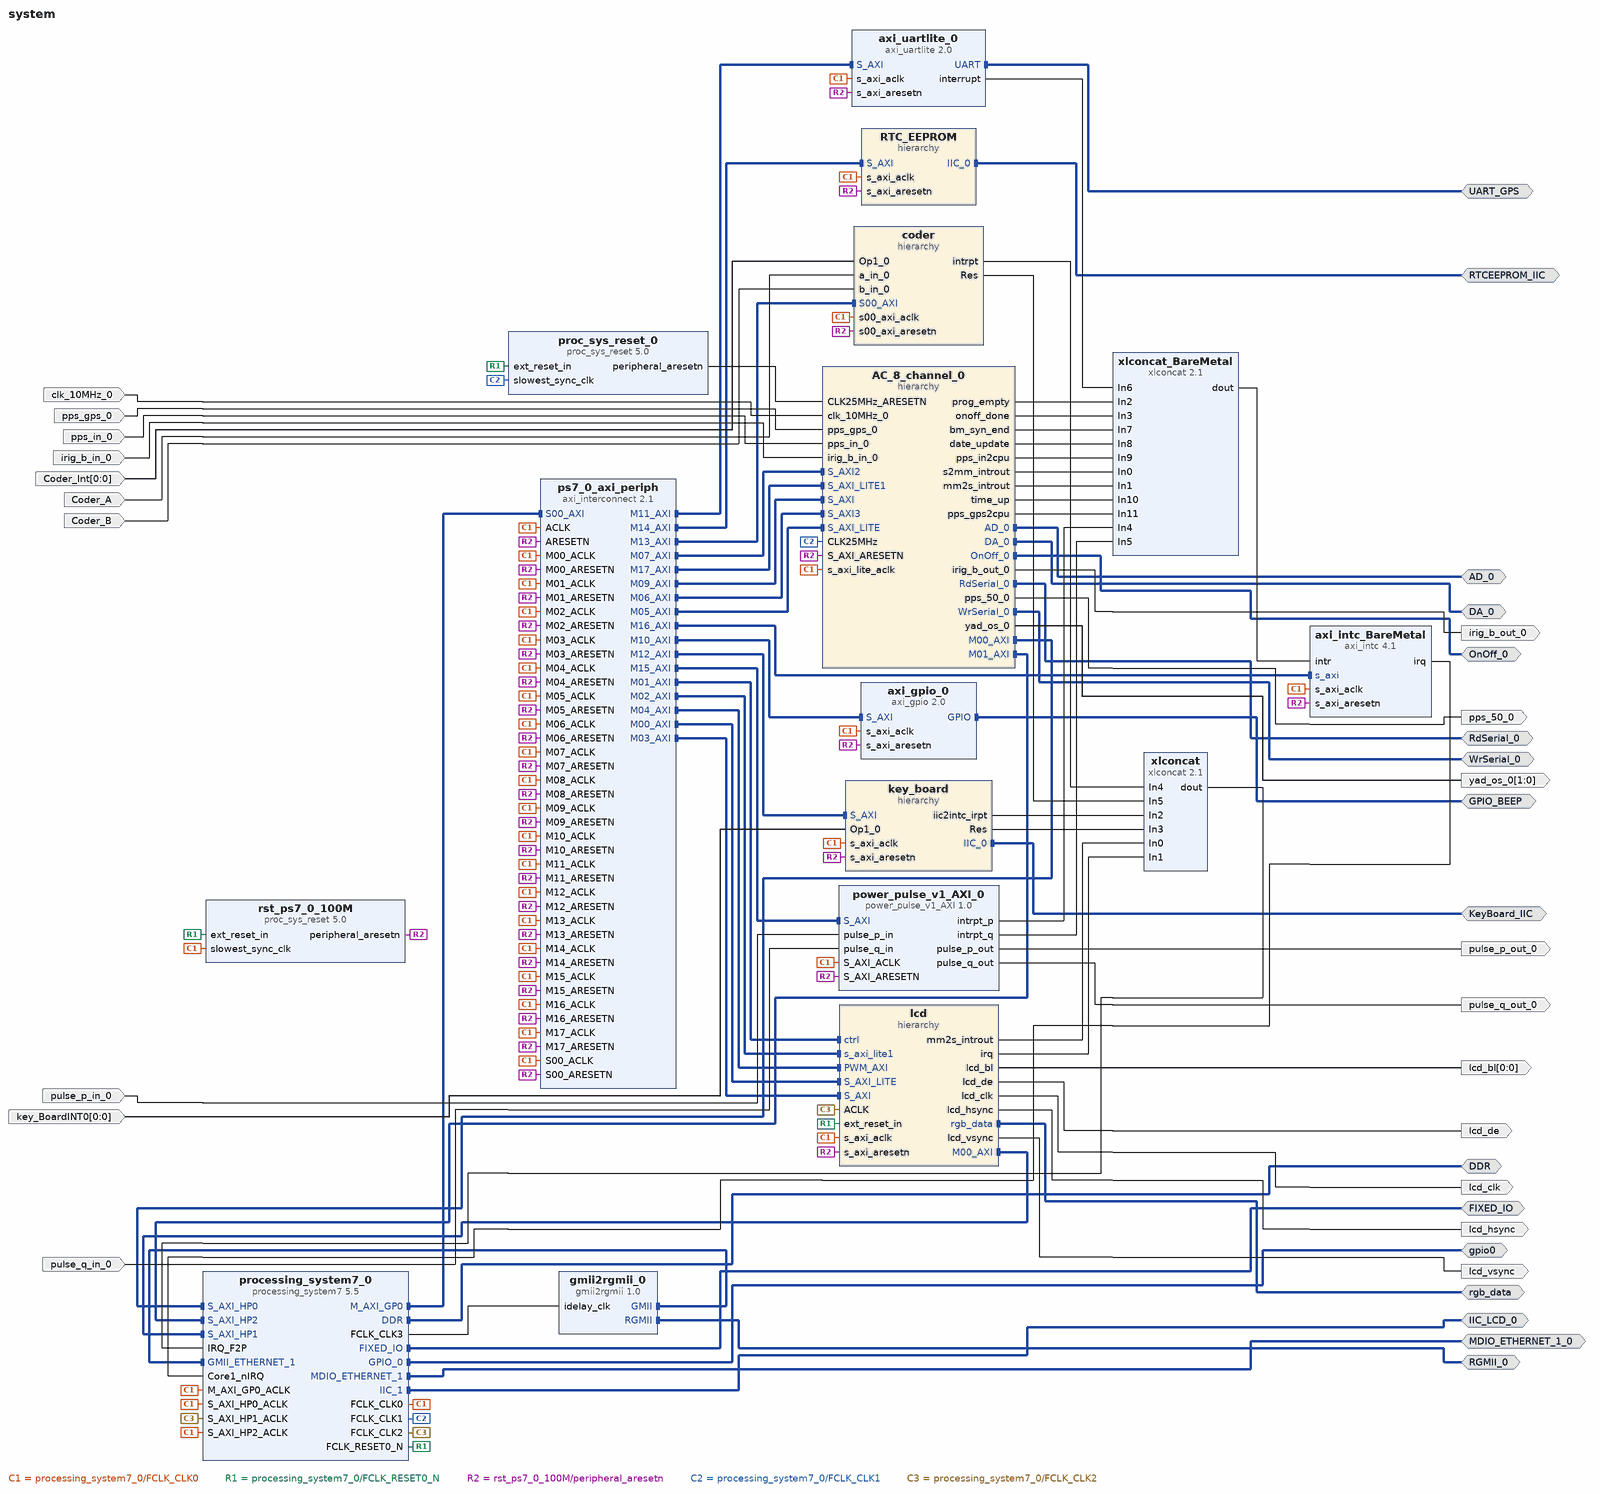
[diagram p0: block diagram of the top level]
# Vivado block design system, xc7z020clg400-2, Vivado 2020.2
create_bd_design system

create_bd_intf_port -mode Master -vlnv xilinx.com:interface:ddrx_rtl:1.0 DDR
create_bd_intf_port -mode Master -vlnv xilinx.com:display_processing_system7:fixedio_rtl:1.0 FIXED_IO
create_bd_intf_port -mode Master -vlnv xilinx.com:interface:gpio_rtl:1.0 rgb_data
create_bd_intf_port -mode Master -vlnv xilinx.com:user:AD_rtl:1.0 AD_0
create_bd_intf_port -mode Master -vlnv xilinx.com:user:DA_rtl:1.0 DA_0
create_bd_intf_port -mode Master -vlnv xilinx.com:user:WrSerial_rtl:1.0 WrSerial_0
create_bd_intf_port -mode Master -vlnv xilinx.com:user:OnOff_rtl:1.0 OnOff_0
create_bd_intf_port -mode Master -vlnv xilinx.com:user:RdSerial_rtl:1.0 RdSerial_0
create_bd_intf_port -mode Master -vlnv xilinx.com:interface:gpio_rtl:1.0 GPIO_BEEP
create_bd_intf_port -mode Master -vlnv xilinx.com:interface:uart_rtl:1.0 UART_GPS
create_bd_intf_port -mode Master -vlnv xilinx.com:interface:iic_rtl:1.0 KeyBoard_IIC
create_bd_intf_port -mode Master -vlnv xilinx.com:interface:rgmii_rtl:1.0 RGMII_0
create_bd_intf_port -mode Master -vlnv xilinx.com:interface:mdio_rtl:1.0 MDIO_ETHERNET_1_0
create_bd_intf_port -mode Master -vlnv xilinx.com:interface:gpio_rtl:1.0 gpio0
create_bd_intf_port -mode Master -vlnv xilinx.com:interface:iic_rtl:1.0 IIC_LCD_0
create_bd_intf_port -mode Master -vlnv xilinx.com:interface:iic_rtl:1.0 RTCEEPROM_IIC
create_bd_port -dir O -from 0 -to 0 lcd_bl
create_bd_port -dir O lcd_de
create_bd_port -dir O lcd_hsync
create_bd_port -dir O lcd_vsync
create_bd_port -dir O -type clk lcd_clk
create_bd_port -dir I -from 0 -to 0 Coder_Int
create_bd_port -dir I Coder_A
create_bd_port -dir I Coder_B
create_bd_port -dir O pulse_p_out_0
create_bd_port -dir O pulse_q_out_0
create_bd_port -dir I pulse_p_in_0
create_bd_port -dir I pulse_q_in_0
create_bd_port -dir O -from 1 -to 0 yad_os_0
create_bd_port -dir I -from 0 -to 0 key_BoardINT0
create_bd_port -dir I clk_10MHz_0
create_bd_port -dir I pps_gps_0
create_bd_port -dir I pps_in_0
create_bd_port -dir I irig_b_in_0
create_bd_port -dir O pps_50_0
create_bd_port -dir O irig_b_out_0

create_bd_cell -type ip -vlnv xilinx.com:ip:processing_system7:5.5 processing_system7_0
set_property -dict [list \
  CONFIG.PCW_APU_PERIPHERAL_FREQMHZ 666.666666 \
  CONFIG.PCW_CORE1_IRQ_INTR 1 \
  CONFIG.PCW_CPU_CPU_6X4X_MAX_RANGE 767 \
  CONFIG.PCW_ENET0_ENET0_IO {MIO 16 .. 27} \
  CONFIG.PCW_ENET0_GRP_MDIO_ENABLE 1 \
  CONFIG.PCW_ENET0_GRP_MDIO_IO {MIO 52 .. 53} \
  CONFIG.PCW_ENET0_PERIPHERAL_ENABLE 1 \
  CONFIG.PCW_ENET0_RESET_ENABLE 0 \
  CONFIG.PCW_ENET1_ENET1_IO EMIO \
  CONFIG.PCW_ENET1_GRP_MDIO_ENABLE 1 \
  CONFIG.PCW_ENET1_GRP_MDIO_IO EMIO \
  CONFIG.PCW_ENET1_PERIPHERAL_ENABLE 1 \
  CONFIG.PCW_ENET_RESET_ENABLE 1 \
  CONFIG.PCW_ENET_RESET_SELECT {Share reset pin} \
  CONFIG.PCW_EN_CLK1_PORT 1 \
  CONFIG.PCW_EN_CLK2_PORT 1 \
  CONFIG.PCW_EN_CLK3_PORT 1 \
  CONFIG.PCW_FCLK_CLK1_BUF TRUE \
  CONFIG.PCW_FCLK_CLK2_BUF TRUE \
  CONFIG.PCW_FCLK_CLK3_BUF TRUE \
  CONFIG.PCW_FPGA0_PERIPHERAL_FREQMHZ 100 \
  CONFIG.PCW_FPGA1_PERIPHERAL_FREQMHZ 25 \
  CONFIG.PCW_FPGA2_PERIPHERAL_FREQMHZ 150 \
  CONFIG.PCW_FPGA3_PERIPHERAL_FREQMHZ 200 \
  CONFIG.PCW_FPGA_FCLK1_ENABLE 1 \
  CONFIG.PCW_FPGA_FCLK2_ENABLE 1 \
  CONFIG.PCW_FPGA_FCLK3_ENABLE 1 \
  CONFIG.PCW_GPIO_EMIO_GPIO_ENABLE 1 \
  CONFIG.PCW_GPIO_EMIO_GPIO_IO 3 \
  CONFIG.PCW_GPIO_EMIO_GPIO_WIDTH 3 \
  CONFIG.PCW_GPIO_MIO_GPIO_ENABLE 1 \
  CONFIG.PCW_GPIO_MIO_GPIO_IO MIO \
  CONFIG.PCW_I2C1_I2C1_IO EMIO \
  CONFIG.PCW_I2C1_PERIPHERAL_ENABLE 1 \
  CONFIG.PCW_I2C_PERIPHERAL_FREQMHZ 111.111115 \
  CONFIG.PCW_I2C_RESET_ENABLE 1 \
  CONFIG.PCW_I2C_RESET_SELECT {Share reset pin} \
  CONFIG.PCW_IRQ_F2P_INTR 1 \
  CONFIG.PCW_PERIPHERAL_BOARD_PRESET None \
  CONFIG.PCW_PRESET_BANK1_VOLTAGE {LVCMOS 1.8V} \
  CONFIG.PCW_QSPI_GRP_SINGLE_SS_ENABLE 1 \
  CONFIG.PCW_QSPI_GRP_SINGLE_SS_IO {MIO 1 .. 6} \
  CONFIG.PCW_QSPI_PERIPHERAL_ENABLE 1 \
  CONFIG.PCW_QSPI_QSPI_IO {MIO 1 .. 6} \
  CONFIG.PCW_SD0_GRP_CD_ENABLE 1 \
  CONFIG.PCW_SD0_GRP_CD_IO {MIO 9} \
  CONFIG.PCW_SD0_GRP_WP_ENABLE 0 \
  CONFIG.PCW_SD0_PERIPHERAL_ENABLE 1 \
  CONFIG.PCW_SD0_SD0_IO {MIO 40 .. 45} \
  CONFIG.PCW_SD1_PERIPHERAL_ENABLE 1 \
  CONFIG.PCW_SD1_SD1_IO {MIO 46 .. 51} \
  CONFIG.PCW_SDIO_PERIPHERAL_FREQMHZ 100 \
  CONFIG.PCW_SINGLE_QSPI_DATA_MODE x4 \
  CONFIG.PCW_TTC0_PERIPHERAL_ENABLE 1 \
  CONFIG.PCW_TTC0_TTC0_IO EMIO \
  CONFIG.PCW_UART0_PERIPHERAL_ENABLE 1 \
  CONFIG.PCW_UART0_UART0_IO {MIO 14 .. 15} \
  CONFIG.PCW_UART1_PERIPHERAL_ENABLE 1 \
  CONFIG.PCW_UART1_UART1_IO {MIO 12 .. 13} \
  CONFIG.PCW_UART_PERIPHERAL_FREQMHZ 100 \
  CONFIG.PCW_UIPARAM_DDR_FREQ_MHZ 533.333333 \
  CONFIG.PCW_UIPARAM_DDR_PARTNO {MT41J256M16 RE-125} \
  CONFIG.PCW_USB0_PERIPHERAL_ENABLE 1 \
  CONFIG.PCW_USB0_RESET_ENABLE 1 \
  CONFIG.PCW_USB0_RESET_IO {MIO 8} \
  CONFIG.PCW_USB0_USB0_IO {MIO 28 .. 39} \
  CONFIG.PCW_USB_RESET_ENABLE 1 \
  CONFIG.PCW_USB_RESET_SELECT {Share reset pin} \
  CONFIG.PCW_USE_FABRIC_INTERRUPT 1 \
  CONFIG.PCW_USE_S_AXI_HP0 1 \
  CONFIG.PCW_USE_S_AXI_HP1 1 \
  CONFIG.PCW_USE_S_AXI_HP2 1 \
] [get_bd_cells processing_system7_0]
# 518 more settings of processing_system7_0 are not shown: defaults, MIO pin electricals, DDR timing, and values the tool derives
create_bd_cell -type ip -vlnv xilinx.com:ip:proc_sys_reset:5.0 rst_ps7_0_100M
create_bd_cell -type ip -vlnv xilinx.com:ip:axi_interconnect:2.1 ps7_0_axi_periph
set_property -dict {CONFIG.NUM_MI 18} [get_bd_cells ps7_0_axi_periph]
create_bd_cell -type ip -vlnv xilinx.com:ip:proc_sys_reset:5.0 proc_sys_reset_0
create_bd_cell -type ip -vlnv xilinx.com:ip:xlconcat:2.1 xlconcat
set_property -dict {CONFIG.NUM_PORTS 6} [get_bd_cells xlconcat]
create_bd_cell -type hier lcd
create_bd_cell -type ip -vlnv xilinx.com:ip:axi_gpio:2.0 axi_gpio_0
set_property -dict {CONFIG.C_ALL_INPUTS 0 CONFIG.C_ALL_OUTPUTS 1 CONFIG.C_GPIO_WIDTH 1} [get_bd_cells axi_gpio_0]
create_bd_cell -type ip -vlnv xilinx.com:ip:axi_uartlite:2.0 axi_uartlite_0
set_property -dict {CONFIG.C_BAUDRATE 9600} [get_bd_cells axi_uartlite_0]
create_bd_cell -type hier key_board
create_bd_cell -type hier coder
create_bd_cell -type ip -vlnv xilinx.com:user:gmii2rgmii:1.0 gmii2rgmii_0
create_bd_cell -type hier AC_8_channel_0
create_bd_cell -type hier RTC_EEPROM
create_bd_cell -type ip -vlnv xilinx.com:user:power_pulse_v1_AXI:1.0 power_pulse_v1_AXI_0
create_bd_cell -type ip -vlnv xilinx.com:ip:axi_intc:4.1 axi_intc_BareMetal
set_property -dict [list \
  CONFIG.C_IRQ_CONNECTION 1 \
  CONFIG.C_IRQ_IS_LEVEL 1 \
  CONFIG.C_KIND_OF_INTR 0xFFFFFFFF \
  CONFIG.C_NUM_SW_INTR 0 \
] [get_bd_cells axi_intc_BareMetal]
create_bd_cell -type ip -vlnv xilinx.com:ip:xlconcat:2.1 xlconcat_BareMetal
set_property -dict {CONFIG.NUM_PORTS 12} [get_bd_cells xlconcat_BareMetal]

# ---- hierarchy /lcd ----
current_bd_instance /lcd
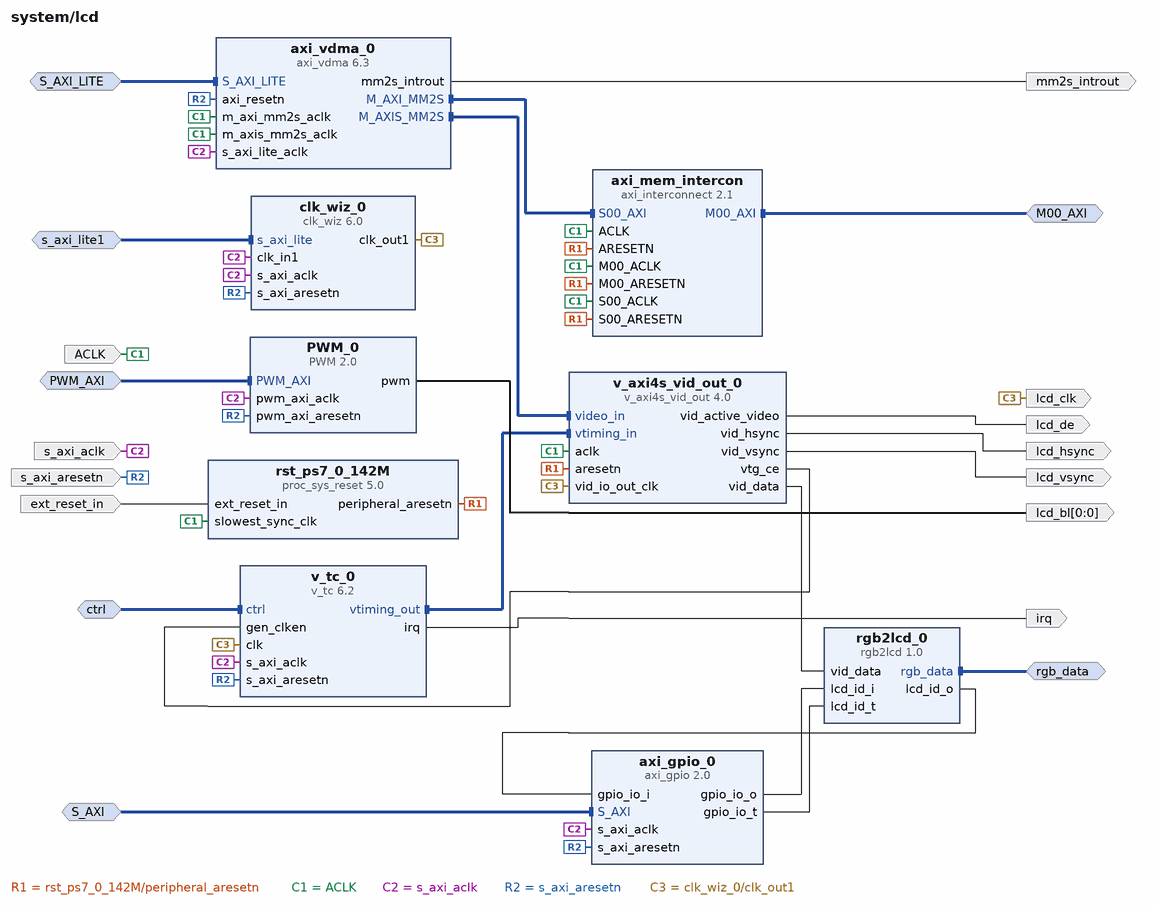
[diagram p1: block diagram inside /lcd]
create_bd_intf_pin -mode Slave -vlnv xilinx.com:interface:aximm_rtl:1.0 S_AXI_LITE
create_bd_intf_pin -mode Slave -vlnv xilinx.com:interface:aximm_rtl:1.0 S_AXI
create_bd_intf_pin -mode Master -vlnv xilinx.com:interface:gpio_rtl:1.0 rgb_data
create_bd_intf_pin -mode Slave -vlnv xilinx.com:interface:aximm_rtl:1.0 ctrl
create_bd_intf_pin -mode Slave -vlnv xilinx.com:interface:aximm_rtl:1.0 s_axi_lite1
create_bd_intf_pin -mode Slave -vlnv xilinx.com:interface:aximm_rtl:1.0 PWM_AXI
create_bd_intf_pin -mode Master -vlnv xilinx.com:interface:aximm_rtl:1.0 M00_AXI
create_bd_pin -dir I -type clk ACLK
create_bd_pin -dir I -type rst ext_reset_in
create_bd_pin -dir I -type clk s_axi_aclk
create_bd_pin -dir I -type rst s_axi_aresetn
create_bd_pin -dir O -type intr mm2s_introut
create_bd_pin -dir O -type clk lcd_clk
create_bd_pin -dir O lcd_de
create_bd_pin -dir O lcd_vsync
create_bd_pin -dir O lcd_hsync
create_bd_pin -dir O -type intr irq
create_bd_pin -dir O -from 0 -to 0 lcd_bl

create_bd_cell -type ip -vlnv xilinx.com:ip:proc_sys_reset:5.0 rst_ps7_0_142M
create_bd_cell -type ip -vlnv xilinx.com:ip:axi_vdma:6.3 axi_vdma_0
set_property -dict [list \
  CONFIG.c_include_s2mm 0 \
  CONFIG.c_m_axis_mm2s_tdata_width 24 \
  CONFIG.c_mm2s_linebuffer_depth 4096 \
  CONFIG.c_mm2s_max_burst_length 16 \
  CONFIG.c_num_fstores 1 \
] [get_bd_cells axi_vdma_0]
create_bd_cell -type ip -vlnv xilinx.com:ip:axi_gpio:2.0 axi_gpio_0
set_property -dict {CONFIG.C_GPIO_WIDTH 3} [get_bd_cells axi_gpio_0]
create_bd_cell -type ip -vlnv xilinx.com:ip:v_axi4s_vid_out:4.0 v_axi4s_vid_out_0
set_property -dict {CONFIG.C_HAS_ASYNC_CLK 1} [get_bd_cells v_axi4s_vid_out_0]
create_bd_cell -type ip -vlnv xilinx.com:ip:v_tc:6.2 v_tc_0
set_property -dict {CONFIG.enable_detection false} [get_bd_cells v_tc_0]
create_bd_cell -type ip -vlnv xilinx.com:ip:clk_wiz:6.0 clk_wiz_0
set_property -dict [list \
  CONFIG.CLKOUT2_REQUESTED_OUT_FREQ 100.000 \
  CONFIG.CLKOUT2_USED false \
  CONFIG.CLKOUT3_REQUESTED_OUT_FREQ 100.000 \
  CONFIG.CLKOUT3_USED false \
  CONFIG.MMCM_CLKOUT1_DIVIDE 1 \
  CONFIG.MMCM_CLKOUT2_DIVIDE 1 \
  CONFIG.NUM_OUT_CLKS 1 \
  CONFIG.USE_DYN_RECONFIG true \
  CONFIG.USE_RESET true \
] [get_bd_cells clk_wiz_0]
create_bd_cell -type ip -vlnv digilentinc.com:IP:PWM:2.0 PWM_0
create_bd_cell -type ip -vlnv xilinx.com:ip:axi_interconnect:2.1 axi_mem_intercon
set_property -dict {CONFIG.NUM_MI 1} [get_bd_cells axi_mem_intercon]
create_bd_cell -type ip -vlnv openedv.com:user:rgb2lcd:1.0 rgb2lcd_0

# ---- hierarchy /key_board ----
current_bd_instance /key_board
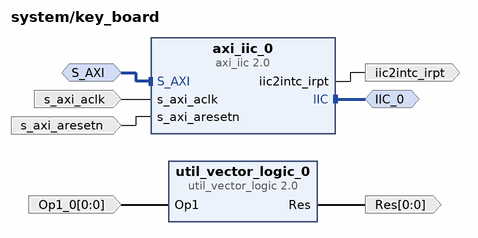
[diagram p2: block diagram inside /key_board]
create_bd_intf_pin -mode Master -vlnv xilinx.com:interface:iic_rtl:1.0 IIC_0
create_bd_intf_pin -mode Slave -vlnv xilinx.com:interface:aximm_rtl:1.0 S_AXI
create_bd_pin -dir I -from 0 -to 0 Op1_0
create_bd_pin -dir O -from 0 -to 0 Res
create_bd_pin -dir I -type clk s_axi_aclk
create_bd_pin -dir I -type rst s_axi_aresetn
create_bd_pin -dir O -type intr iic2intc_irpt

create_bd_cell -type ip -vlnv xilinx.com:ip:axi_iic:2.0 axi_iic_0
create_bd_cell -type ip -vlnv xilinx.com:ip:util_vector_logic:2.0 util_vector_logic_0
set_property -dict {CONFIG.C_OPERATION not CONFIG.C_SIZE 1} [get_bd_cells util_vector_logic_0]

# ---- hierarchy /coder ----
current_bd_instance /coder
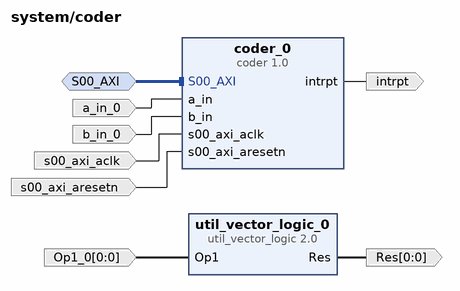
[diagram p3: block diagram inside /coder]
create_bd_intf_pin -mode Slave -vlnv xilinx.com:interface:aximm_rtl:1.0 S00_AXI
create_bd_pin -dir O intrpt
create_bd_pin -dir O -from 0 -to 0 Res
create_bd_pin -dir I -from 0 -to 0 Op1_0
create_bd_pin -dir I a_in_0
create_bd_pin -dir I b_in_0
create_bd_pin -dir I -type clk s00_axi_aclk
create_bd_pin -dir I -type rst s00_axi_aresetn

create_bd_cell -type ip -vlnv xilinx.com:user:coder:1.0 coder_0
create_bd_cell -type ip -vlnv xilinx.com:ip:util_vector_logic:2.0 util_vector_logic_0
set_property -dict {CONFIG.C_OPERATION not CONFIG.C_SIZE 1} [get_bd_cells util_vector_logic_0]

# ---- hierarchy /AC_8_channel_0 ----
current_bd_instance /AC_8_channel_0
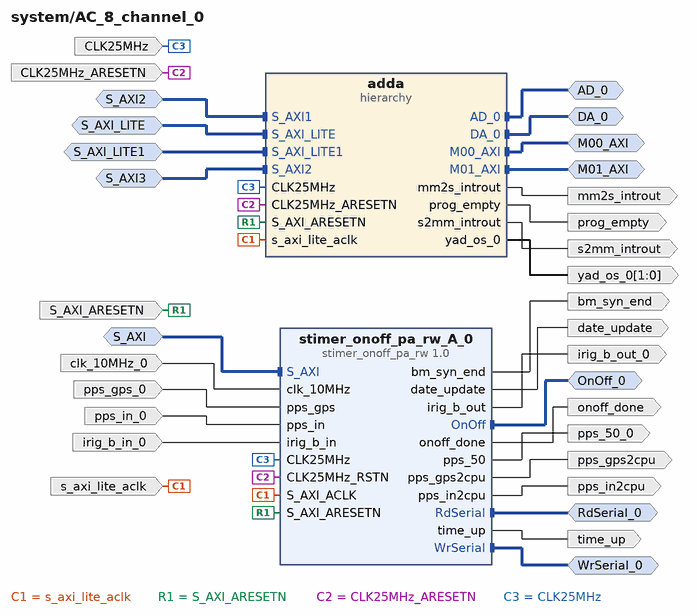
[diagram p4: block diagram inside /AC_8_channel_0]
create_bd_intf_pin -mode Slave -vlnv xilinx.com:interface:aximm_rtl:1.0 S_AXI
create_bd_intf_pin -mode Master -vlnv xilinx.com:user:OnOff_rtl:1.0 OnOff_0
create_bd_intf_pin -mode Master -vlnv xilinx.com:user:WrSerial_rtl:1.0 WrSerial_0
create_bd_intf_pin -mode Master -vlnv xilinx.com:user:RdSerial_rtl:1.0 RdSerial_0
create_bd_intf_pin -mode Slave -vlnv xilinx.com:interface:aximm_rtl:1.0 S_AXI2
create_bd_intf_pin -mode Master -vlnv xilinx.com:user:DA_rtl:1.0 DA_0
create_bd_intf_pin -mode Slave -vlnv xilinx.com:interface:aximm_rtl:1.0 S_AXI_LITE
create_bd_intf_pin -mode Slave -vlnv xilinx.com:interface:aximm_rtl:1.0 S_AXI3
create_bd_intf_pin -mode Master -vlnv xilinx.com:user:AD_rtl:1.0 AD_0
create_bd_intf_pin -mode Master -vlnv xilinx.com:interface:aximm_rtl:1.0 M00_AXI
create_bd_intf_pin -mode Slave -vlnv xilinx.com:interface:aximm_rtl:1.0 S_AXI_LITE1
create_bd_intf_pin -mode Master -vlnv xilinx.com:interface:aximm_rtl:1.0 M01_AXI
create_bd_pin -dir I CLK25MHz
create_bd_pin -dir I -type rst CLK25MHz_ARESETN
create_bd_pin -dir I -type clk s_axi_lite_aclk
create_bd_pin -dir I -type rst S_AXI_ARESETN
create_bd_pin -dir O prog_empty
create_bd_pin -dir O -type intr mm2s_introut
create_bd_pin -dir O -type intr s2mm_introut
create_bd_pin -dir O -from 1 -to 0 yad_os_0
create_bd_pin -dir I clk_10MHz_0
create_bd_pin -dir I pps_gps_0
create_bd_pin -dir I pps_in_0
create_bd_pin -dir I irig_b_in_0
create_bd_pin -dir O pps_50_0
create_bd_pin -dir O irig_b_out_0
create_bd_pin -dir O onoff_done
create_bd_pin -dir O bm_syn_end
create_bd_pin -dir O date_update
create_bd_pin -dir O pps_in2cpu
create_bd_pin -dir O time_up
create_bd_pin -dir O pps_gps2cpu

create_bd_cell -type hier adda
create_bd_cell -type ip -vlnv xilinx.com:user:stimer_onoff_pa_rw:1.0 stimer_onoff_pa_rw_A_0

# ---- hierarchy /AC_8_channel_0/adda ----
current_bd_instance /AC_8_channel_0/adda
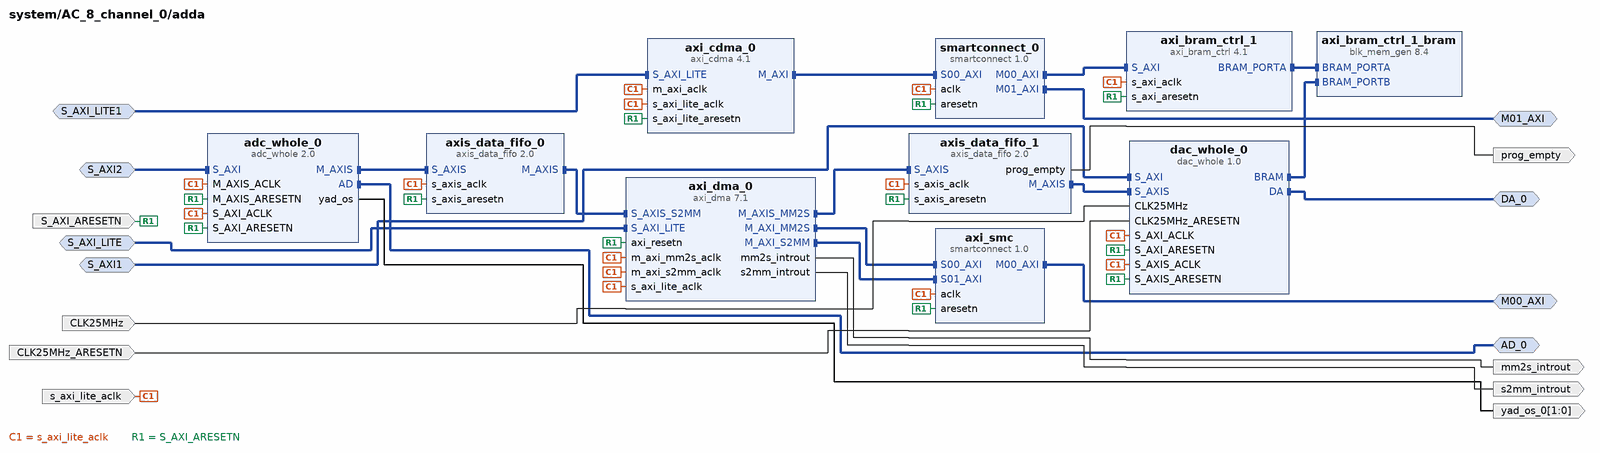
[diagram p5: block diagram inside /AC_8_channel_0/adda]
create_bd_intf_pin -mode Slave -vlnv xilinx.com:interface:aximm_rtl:1.0 S_AXI1
create_bd_intf_pin -mode Master -vlnv xilinx.com:user:DA_rtl:1.0 DA_0
create_bd_intf_pin -mode Slave -vlnv xilinx.com:interface:aximm_rtl:1.0 S_AXI_LITE
create_bd_intf_pin -mode Slave -vlnv xilinx.com:interface:aximm_rtl:1.0 S_AXI2
create_bd_intf_pin -mode Master -vlnv xilinx.com:user:AD_rtl:1.0 AD_0
create_bd_intf_pin -mode Master -vlnv xilinx.com:interface:aximm_rtl:1.0 M00_AXI
create_bd_intf_pin -mode Slave -vlnv xilinx.com:interface:aximm_rtl:1.0 S_AXI_LITE1
create_bd_intf_pin -mode Master -vlnv xilinx.com:interface:aximm_rtl:1.0 M01_AXI
create_bd_pin -dir I -type clk s_axi_lite_aclk
create_bd_pin -dir I -type rst S_AXI_ARESETN
create_bd_pin -dir I CLK25MHz
create_bd_pin -dir I -type rst CLK25MHz_ARESETN
create_bd_pin -dir O prog_empty
create_bd_pin -dir O -type intr mm2s_introut
create_bd_pin -dir O -type intr s2mm_introut
create_bd_pin -dir O -from 1 -to 0 yad_os_0

create_bd_cell -type ip -vlnv xilinx.com:user:dac_whole:1.0 dac_whole_0
create_bd_cell -type ip -vlnv xilinx.com:ip:axis_data_fifo:2.0 axis_data_fifo_1
set_property -dict [list \
  CONFIG.FIFO_DEPTH 2048 \
  CONFIG.HAS_PROG_EMPTY 1 \
  CONFIG.HAS_PROG_FULL 0 \
  CONFIG.HAS_TKEEP 0 \
  CONFIG.HAS_TLAST 0 \
  CONFIG.PROG_EMPTY_THRESH 1024 \
] [get_bd_cells axis_data_fifo_1]
create_bd_cell -type ip -vlnv xilinx.com:ip:axi_dma:7.1 axi_dma_0
set_property -dict [list \
  CONFIG.c_include_sg 0 \
  CONFIG.c_m_axi_mm2s_data_width 128 \
  CONFIG.c_m_axis_mm2s_tdata_width 128 \
  CONFIG.c_mm2s_burst_size 256 \
  CONFIG.c_s2mm_burst_size 256 \
  CONFIG.c_sg_length_width 23 \
] [get_bd_cells axi_dma_0]
create_bd_cell -type ip -vlnv xilinx.com:ip:smartconnect:1.0 axi_smc
set_property -dict {CONFIG.NUM_CLKS 1 CONFIG.NUM_SI 2} [get_bd_cells axi_smc]
create_bd_cell -type ip -vlnv xilinx.com:ip:axi_cdma:4.1 axi_cdma_0
set_property -dict [list \
  CONFIG.C_INCLUDE_DRE 1 \
  CONFIG.C_INCLUDE_SG 0 \
  CONFIG.C_M_AXI_DATA_WIDTH 32 \
  CONFIG.C_M_AXI_MAX_BURST_LEN 32 \
  CONFIG.C_USE_DATAMOVER_LITE 0 \
] [get_bd_cells axi_cdma_0]
create_bd_cell -type ip -vlnv xilinx.com:ip:axi_bram_ctrl:4.1 axi_bram_ctrl_1
set_property -dict {CONFIG.DATA_WIDTH 32 CONFIG.SINGLE_PORT_BRAM 1} [get_bd_cells axi_bram_ctrl_1]
create_bd_cell -type ip -vlnv xilinx.com:ip:blk_mem_gen:8.4 axi_bram_ctrl_1_bram
set_property -dict [list \
  CONFIG.EN_SAFETY_CKT false \
  CONFIG.Enable_B Use_ENB_Pin \
  CONFIG.Memory_Type True_Dual_Port_RAM \
  CONFIG.Port_A_Write_Rate 50 \
  CONFIG.Port_B_Clock 100 \
  CONFIG.Port_B_Enable_Rate 100 \
  CONFIG.Port_B_Write_Rate 50 \
  CONFIG.Use_RSTB_Pin true \
] [get_bd_cells axi_bram_ctrl_1_bram]
create_bd_cell -type ip -vlnv xilinx.com:ip:smartconnect:1.0 smartconnect_0
set_property -dict {CONFIG.NUM_MI 2 CONFIG.NUM_SI 1} [get_bd_cells smartconnect_0]
create_bd_cell -type ip -vlnv xilinx.com:ip:axis_data_fifo:2.0 axis_data_fifo_0
set_property -dict {CONFIG.FIFO_DEPTH 2048 CONFIG.FIFO_MODE 1 CONFIG.HAS_WR_DATA_COUNT 0} [get_bd_cells axis_data_fifo_0]
create_bd_cell -type ip -vlnv xilinx.com:user:adc_whole:2.0 adc_whole_0

# ---- hierarchy /RTC_EEPROM ----
current_bd_instance /RTC_EEPROM
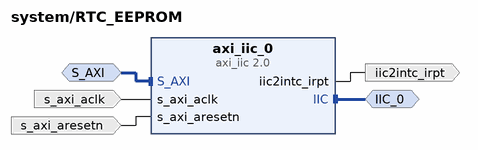
[diagram p6: block diagram inside /RTC_EEPROM]
create_bd_intf_pin -mode Master -vlnv xilinx.com:interface:iic_rtl:1.0 IIC_0
create_bd_intf_pin -mode Slave -vlnv xilinx.com:interface:aximm_rtl:1.0 S_AXI
create_bd_pin -dir O -type intr iic2intc_irpt
create_bd_pin -dir I -type clk s_axi_aclk
create_bd_pin -dir I -type rst s_axi_aresetn

create_bd_cell -type ip -vlnv xilinx.com:ip:axi_iic:2.0 axi_iic_0

# ---- connections ----

current_bd_instance /lcd
connect_bd_intf_net [get_bd_intf_pins M00_AXI] [get_bd_intf_pins axi_mem_intercon/M00_AXI]
connect_bd_intf_net [get_bd_intf_pins s_axi_lite1] [get_bd_intf_pins clk_wiz_0/s_axi_lite]
connect_bd_intf_net [get_bd_intf_pins v_axi4s_vid_out_0/vtiming_in] [get_bd_intf_pins v_tc_0/vtiming_out]
connect_bd_intf_net [get_bd_intf_pins rgb_data] [get_bd_intf_pins rgb2lcd_0/rgb_data]
connect_bd_intf_net [get_bd_intf_pins S_AXI] [get_bd_intf_pins axi_gpio_0/S_AXI]
connect_bd_intf_net [get_bd_intf_pins v_axi4s_vid_out_0/video_in] [get_bd_intf_pins axi_vdma_0/M_AXIS_MM2S]
connect_bd_intf_net [get_bd_intf_pins ctrl] [get_bd_intf_pins v_tc_0/ctrl]
connect_bd_intf_net [get_bd_intf_pins PWM_AXI] [get_bd_intf_pins PWM_0/PWM_AXI]
connect_bd_intf_net [get_bd_intf_pins S_AXI_LITE] [get_bd_intf_pins axi_vdma_0/S_AXI_LITE]
connect_bd_intf_net [get_bd_intf_pins axi_vdma_0/M_AXI_MM2S] [get_bd_intf_pins axi_mem_intercon/S00_AXI]
connect_bd_net [get_bd_pins rst_ps7_0_142M/peripheral_aresetn] \
  [get_bd_pins axi_mem_intercon/M00_ARESETN] [get_bd_pins axi_mem_intercon/ARESETN] \
  [get_bd_pins axi_mem_intercon/S00_ARESETN] [get_bd_pins v_axi4s_vid_out_0/aresetn]
connect_bd_net [get_bd_pins rgb2lcd_0/lcd_id_o] [get_bd_pins axi_gpio_0/gpio_io_i]
connect_bd_net [get_bd_pins axi_gpio_0/gpio_io_o] [get_bd_pins rgb2lcd_0/lcd_id_i]
connect_bd_net [get_bd_pins axi_gpio_0/gpio_io_t] [get_bd_pins rgb2lcd_0/lcd_id_t]
connect_bd_net [get_bd_pins v_axi4s_vid_out_0/vid_data] [get_bd_pins rgb2lcd_0/vid_data]
connect_bd_net [get_bd_pins v_axi4s_vid_out_0/vtg_ce] [get_bd_pins v_tc_0/gen_clken]
connect_bd_net -net processing_system7_0_FCLK_CLK2 [get_bd_pins ACLK] \
  [get_bd_pins axi_mem_intercon/ACLK] [get_bd_pins axi_mem_intercon/M00_ACLK] [get_bd_pins axi_mem_intercon/S00_ACLK] \
  [get_bd_pins axi_vdma_0/m_axi_mm2s_aclk] [get_bd_pins axi_vdma_0/m_axis_mm2s_aclk] [get_bd_pins v_axi4s_vid_out_0/aclk] \
  [get_bd_pins rst_ps7_0_142M/slowest_sync_clk]
connect_bd_net -net processing_system7_0_FCLK_RESET0_N [get_bd_pins ext_reset_in] [get_bd_pins rst_ps7_0_142M/ext_reset_in]
connect_bd_net -net processing_system7_0_FCLK_CLK0 [get_bd_pins s_axi_aclk] \
  [get_bd_pins axi_gpio_0/s_axi_aclk] [get_bd_pins clk_wiz_0/s_axi_aclk] [get_bd_pins clk_wiz_0/clk_in1] \
  [get_bd_pins v_tc_0/s_axi_aclk] [get_bd_pins PWM_0/pwm_axi_aclk] [get_bd_pins axi_vdma_0/s_axi_lite_aclk]
connect_bd_net -net rst_ps7_0_100M_peripheral_aresetn [get_bd_pins s_axi_aresetn] \
  [get_bd_pins axi_gpio_0/s_axi_aresetn] [get_bd_pins clk_wiz_0/s_axi_aresetn] [get_bd_pins v_tc_0/s_axi_aresetn] \
  [get_bd_pins PWM_0/pwm_axi_aresetn] [get_bd_pins axi_vdma_0/axi_resetn]
connect_bd_net [get_bd_pins axi_vdma_0/mm2s_introut] [get_bd_pins mm2s_introut]
connect_bd_net [get_bd_pins clk_wiz_0/clk_out1] [get_bd_pins lcd_clk] [get_bd_pins v_tc_0/clk] [get_bd_pins v_axi4s_vid_out_0/vid_io_out_clk]
connect_bd_net [get_bd_pins v_axi4s_vid_out_0/vid_active_video] [get_bd_pins lcd_de]
connect_bd_net [get_bd_pins v_axi4s_vid_out_0/vid_vsync] [get_bd_pins lcd_vsync]
connect_bd_net [get_bd_pins v_axi4s_vid_out_0/vid_hsync] [get_bd_pins lcd_hsync]
connect_bd_net [get_bd_pins v_tc_0/irq] [get_bd_pins irq]
connect_bd_net [get_bd_pins PWM_0/pwm] [get_bd_pins lcd_bl]

current_bd_instance /key_board
connect_bd_intf_net [get_bd_intf_pins IIC_0] [get_bd_intf_pins axi_iic_0/IIC]
connect_bd_intf_net [get_bd_intf_pins S_AXI] [get_bd_intf_pins axi_iic_0/S_AXI]
connect_bd_net [get_bd_pins s_axi_aclk] [get_bd_pins axi_iic_0/s_axi_aclk]
connect_bd_net [get_bd_pins s_axi_aresetn] [get_bd_pins axi_iic_0/s_axi_aresetn]
connect_bd_net [get_bd_pins axi_iic_0/iic2intc_irpt] [get_bd_pins iic2intc_irpt]
connect_bd_net [get_bd_pins util_vector_logic_0/Res] [get_bd_pins Res]
connect_bd_net -net Op1_0_1 [get_bd_pins Op1_0] [get_bd_pins util_vector_logic_0/Op1]

current_bd_instance /coder
connect_bd_intf_net [get_bd_intf_pins S00_AXI] [get_bd_intf_pins coder_0/S00_AXI]
connect_bd_net [get_bd_pins coder_0/intrpt] [get_bd_pins intrpt]
connect_bd_net [get_bd_pins util_vector_logic_0/Res] [get_bd_pins Res]
connect_bd_net -net Op1_0_1 [get_bd_pins Op1_0] [get_bd_pins util_vector_logic_0/Op1]
connect_bd_net -net a_in_0_1 [get_bd_pins a_in_0] [get_bd_pins coder_0/a_in]
connect_bd_net -net b_in_0_1 [get_bd_pins b_in_0] [get_bd_pins coder_0/b_in]
connect_bd_net [get_bd_pins s00_axi_aclk] [get_bd_pins coder_0/s00_axi_aclk]
connect_bd_net [get_bd_pins s00_axi_aresetn] [get_bd_pins coder_0/s00_axi_aresetn]

current_bd_instance /AC_8_channel_0
connect_bd_intf_net [get_bd_intf_pins S_AXI2] [get_bd_intf_pins adda/S_AXI1]
connect_bd_intf_net -intf_net dac_whole_0_DA [get_bd_intf_pins DA_0] [get_bd_intf_pins adda/DA_0]
connect_bd_intf_net [get_bd_intf_pins RdSerial_0] [get_bd_intf_pins stimer_onoff_pa_rw_A_0/RdSerial]
connect_bd_intf_net [get_bd_intf_pins S_AXI] [get_bd_intf_pins stimer_onoff_pa_rw_A_0/S_AXI]
connect_bd_intf_net [get_bd_intf_pins S_AXI_LITE] [get_bd_intf_pins adda/S_AXI_LITE]
connect_bd_intf_net [get_bd_intf_pins S_AXI_LITE1] [get_bd_intf_pins adda/S_AXI_LITE1]
connect_bd_intf_net [get_bd_intf_pins M00_AXI] [get_bd_intf_pins adda/M00_AXI]
connect_bd_intf_net [get_bd_intf_pins WrSerial_0] [get_bd_intf_pins stimer_onoff_pa_rw_A_0/WrSerial]
connect_bd_intf_net -intf_net adc_whole_0_AD [get_bd_intf_pins AD_0] [get_bd_intf_pins adda/AD_0]
connect_bd_intf_net [get_bd_intf_pins M01_AXI] [get_bd_intf_pins adda/M01_AXI]
connect_bd_intf_net [get_bd_intf_pins OnOff_0] [get_bd_intf_pins stimer_onoff_pa_rw_A_0/OnOff]
connect_bd_intf_net [get_bd_intf_pins S_AXI3] [get_bd_intf_pins adda/S_AXI2]
connect_bd_net -net processing_system7_0_FCLK_CLK0 [get_bd_pins s_axi_lite_aclk] \
  [get_bd_pins adda/s_axi_lite_aclk] [get_bd_pins stimer_onoff_pa_rw_A_0/S_AXI_ACLK]
connect_bd_net -net rst_ps7_0_100M_peripheral_aresetn [get_bd_pins S_AXI_ARESETN] \
  [get_bd_pins adda/S_AXI_ARESETN] [get_bd_pins stimer_onoff_pa_rw_A_0/S_AXI_ARESETN]
connect_bd_net -net axis_data_fifo_1_prog_empty [get_bd_pins adda/prog_empty] [get_bd_pins prog_empty]
connect_bd_net -net axi_dma_0_mm2s_introut [get_bd_pins adda/mm2s_introut] [get_bd_pins mm2s_introut]
connect_bd_net -net axi_dma_0_s2mm_introut [get_bd_pins adda/s2mm_introut] [get_bd_pins s2mm_introut]
connect_bd_net -net proc_sys_reset_0_peripheral_aresetn [get_bd_pins CLK25MHz_ARESETN] \
  [get_bd_pins adda/CLK25MHz_ARESETN] [get_bd_pins stimer_onoff_pa_rw_A_0/CLK25MHz_RSTN]
connect_bd_net -net processing_system7_0_FCLK_CLK1 [get_bd_pins CLK25MHz] [get_bd_pins adda/CLK25MHz] [get_bd_pins stimer_onoff_pa_rw_A_0/CLK25MHz]
connect_bd_net [get_bd_pins adda/yad_os_0] [get_bd_pins yad_os_0]
connect_bd_net -net clk_10MHz_0_1 [get_bd_pins clk_10MHz_0] [get_bd_pins stimer_onoff_pa_rw_A_0/clk_10MHz]
connect_bd_net -net pps_gps_0_1 [get_bd_pins pps_gps_0] [get_bd_pins stimer_onoff_pa_rw_A_0/pps_gps]
connect_bd_net -net pps_in_0_1 [get_bd_pins pps_in_0] [get_bd_pins stimer_onoff_pa_rw_A_0/pps_in]
connect_bd_net -net irig_b_in_0_1 [get_bd_pins irig_b_in_0] [get_bd_pins stimer_onoff_pa_rw_A_0/irig_b_in]
connect_bd_net [get_bd_pins stimer_onoff_pa_rw_A_0/pps_50] [get_bd_pins pps_50_0]
connect_bd_net [get_bd_pins stimer_onoff_pa_rw_A_0/irig_b_out] [get_bd_pins irig_b_out_0]
connect_bd_net [get_bd_pins stimer_onoff_pa_rw_A_0/bm_syn_end] [get_bd_pins bm_syn_end]
connect_bd_net [get_bd_pins stimer_onoff_pa_rw_A_0/onoff_done] [get_bd_pins onoff_done]
connect_bd_net [get_bd_pins stimer_onoff_pa_rw_A_0/date_update] [get_bd_pins date_update]
connect_bd_net [get_bd_pins stimer_onoff_pa_rw_A_0/pps_in2cpu] [get_bd_pins pps_in2cpu]
connect_bd_net [get_bd_pins stimer_onoff_pa_rw_A_0/time_up] [get_bd_pins time_up]
connect_bd_net [get_bd_pins stimer_onoff_pa_rw_A_0/pps_gps2cpu] [get_bd_pins pps_gps2cpu]

current_bd_instance /AC_8_channel_0/adda
connect_bd_intf_net [get_bd_intf_pins M01_AXI] [get_bd_intf_pins smartconnect_0/M01_AXI]
connect_bd_intf_net [get_bd_intf_pins axi_dma_0/M_AXI_MM2S] [get_bd_intf_pins axi_smc/S00_AXI]
connect_bd_intf_net [get_bd_intf_pins S_AXI_LITE] [get_bd_intf_pins axi_dma_0/S_AXI_LITE]
connect_bd_intf_net [get_bd_intf_pins axi_bram_ctrl_1_bram/BRAM_PORTA] [get_bd_intf_pins axi_bram_ctrl_1/BRAM_PORTA]
connect_bd_intf_net [get_bd_intf_pins adc_whole_0/M_AXIS] [get_bd_intf_pins axis_data_fifo_0/S_AXIS]
connect_bd_intf_net [get_bd_intf_pins dac_whole_0/BRAM] [get_bd_intf_pins axi_bram_ctrl_1_bram/BRAM_PORTB]
connect_bd_intf_net [get_bd_intf_pins axi_cdma_0/M_AXI] [get_bd_intf_pins smartconnect_0/S00_AXI]
connect_bd_intf_net [get_bd_intf_pins DA_0] [get_bd_intf_pins dac_whole_0/DA]
connect_bd_intf_net [get_bd_intf_pins S_AXI1] [get_bd_intf_pins dac_whole_0/S_AXI]
connect_bd_intf_net [get_bd_intf_pins axi_dma_0/M_AXI_S2MM] [get_bd_intf_pins axi_smc/S01_AXI]
connect_bd_intf_net [get_bd_intf_pins smartconnect_0/M00_AXI] [get_bd_intf_pins axi_bram_ctrl_1/S_AXI]
connect_bd_intf_net [get_bd_intf_pins S_AXI2] [get_bd_intf_pins adc_whole_0/S_AXI]
connect_bd_intf_net [get_bd_intf_pins M00_AXI] [get_bd_intf_pins axi_smc/M00_AXI]
connect_bd_intf_net [get_bd_intf_pins axis_data_fifo_1/S_AXIS] [get_bd_intf_pins axi_dma_0/M_AXIS_MM2S]
connect_bd_intf_net [get_bd_intf_pins axis_data_fifo_1/M_AXIS] [get_bd_intf_pins dac_whole_0/S_AXIS]
connect_bd_intf_net [get_bd_intf_pins S_AXI_LITE1] [get_bd_intf_pins axi_cdma_0/S_AXI_LITE]
connect_bd_intf_net [get_bd_intf_pins AD_0] [get_bd_intf_pins adc_whole_0/AD]
connect_bd_intf_net [get_bd_intf_pins axis_data_fifo_0/M_AXIS] [get_bd_intf_pins axi_dma_0/S_AXIS_S2MM]
connect_bd_net -net processing_system7_0_FCLK_CLK0 [get_bd_pins s_axi_lite_aclk] \
  [get_bd_pins axi_dma_0/s_axi_lite_aclk] [get_bd_pins axi_dma_0/m_axi_mm2s_aclk] [get_bd_pins axi_dma_0/m_axi_s2mm_aclk] \
  [get_bd_pins dac_whole_0/S_AXIS_ACLK] [get_bd_pins dac_whole_0/S_AXI_ACLK] [get_bd_pins axis_data_fifo_1/s_axis_aclk] \
  [get_bd_pins axi_smc/aclk] [get_bd_pins axi_cdma_0/m_axi_aclk] [get_bd_pins axi_cdma_0/s_axi_lite_aclk] \
  [get_bd_pins axi_bram_ctrl_1/s_axi_aclk] [get_bd_pins smartconnect_0/aclk] [get_bd_pins axis_data_fifo_0/s_axis_aclk] \
  [get_bd_pins adc_whole_0/M_AXIS_ACLK] [get_bd_pins adc_whole_0/S_AXI_ACLK]
connect_bd_net -net rst_ps7_0_100M_peripheral_aresetn [get_bd_pins S_AXI_ARESETN] \
  [get_bd_pins axi_dma_0/axi_resetn] [get_bd_pins dac_whole_0/S_AXIS_ARESETN] [get_bd_pins dac_whole_0/S_AXI_ARESETN] \
  [get_bd_pins axis_data_fifo_1/s_axis_aresetn] [get_bd_pins axi_smc/aresetn] [get_bd_pins axi_cdma_0/s_axi_lite_aresetn] \
  [get_bd_pins axi_bram_ctrl_1/s_axi_aresetn] [get_bd_pins smartconnect_0/aresetn] \
  [get_bd_pins axis_data_fifo_0/s_axis_aresetn] [get_bd_pins adc_whole_0/M_AXIS_ARESETN] \
  [get_bd_pins adc_whole_0/S_AXI_ARESETN]
connect_bd_net -net processing_system7_0_FCLK_CLK1 [get_bd_pins CLK25MHz] [get_bd_pins dac_whole_0/CLK25MHz]
connect_bd_net -net proc_sys_reset_0_peripheral_aresetn [get_bd_pins CLK25MHz_ARESETN] [get_bd_pins dac_whole_0/CLK25MHz_ARESETN]
connect_bd_net [get_bd_pins axis_data_fifo_1/prog_empty] [get_bd_pins prog_empty]
connect_bd_net [get_bd_pins axi_dma_0/mm2s_introut] [get_bd_pins mm2s_introut]
connect_bd_net [get_bd_pins axi_dma_0/s2mm_introut] [get_bd_pins s2mm_introut]
connect_bd_net [get_bd_pins adc_whole_0/yad_os] [get_bd_pins yad_os_0]

current_bd_instance /RTC_EEPROM
connect_bd_intf_net [get_bd_intf_pins S_AXI] [get_bd_intf_pins axi_iic_0/S_AXI]
connect_bd_intf_net [get_bd_intf_pins IIC_0] [get_bd_intf_pins axi_iic_0/IIC]
connect_bd_net [get_bd_pins axi_iic_0/iic2intc_irpt] [get_bd_pins iic2intc_irpt]
connect_bd_net [get_bd_pins s_axi_aclk] [get_bd_pins axi_iic_0/s_axi_aclk]
connect_bd_net [get_bd_pins s_axi_aresetn] [get_bd_pins axi_iic_0/s_axi_aresetn]

current_bd_instance /
connect_bd_intf_net [get_bd_intf_ports DDR] [get_bd_intf_pins processing_system7_0/DDR]
connect_bd_intf_net [get_bd_intf_ports MDIO_ETHERNET_1_0] [get_bd_intf_pins processing_system7_0/MDIO_ETHERNET_1]
connect_bd_intf_net [get_bd_intf_pins AC_8_channel_0/S_AXI2] [get_bd_intf_pins ps7_0_axi_periph/M07_AXI]
connect_bd_intf_net -intf_net adc_whole_0_AD [get_bd_intf_ports AD_0] [get_bd_intf_pins AC_8_channel_0/AD_0]
connect_bd_intf_net [get_bd_intf_ports FIXED_IO] [get_bd_intf_pins processing_system7_0/FIXED_IO]
connect_bd_intf_net [get_bd_intf_pins processing_system7_0/M_AXI_GP0] [get_bd_intf_pins ps7_0_axi_periph/S00_AXI]
connect_bd_intf_net [get_bd_intf_pins ps7_0_axi_periph/M17_AXI] [get_bd_intf_pins AC_8_channel_0/S_AXI_LITE1]
connect_bd_intf_net -intf_net onoff_config_axi_0_RdSerial [get_bd_intf_ports RdSerial_0] [get_bd_intf_pins AC_8_channel_0/RdSerial_0]
connect_bd_intf_net [get_bd_intf_pins AC_8_channel_0/S_AXI] [get_bd_intf_pins ps7_0_axi_periph/M09_AXI]
connect_bd_intf_net [get_bd_intf_ports UART_GPS] [get_bd_intf_pins axi_uartlite_0/UART]
connect_bd_intf_net [get_bd_intf_pins ps7_0_axi_periph/M01_AXI] [get_bd_intf_pins lcd/ctrl]
connect_bd_intf_net -intf_net dac_whole_0_DA [get_bd_intf_ports DA_0] [get_bd_intf_pins AC_8_channel_0/DA_0]
connect_bd_intf_net [get_bd_intf_pins ps7_0_axi_periph/M02_AXI] [get_bd_intf_pins lcd/s_axi_lite1]
connect_bd_intf_net [get_bd_intf_ports gpio0] [get_bd_intf_pins processing_system7_0/GPIO_0]
connect_bd_intf_net [get_bd_intf_pins ps7_0_axi_periph/M16_AXI] [get_bd_intf_pins axi_intc_BareMetal/s_axi]
connect_bd_intf_net [get_bd_intf_pins AC_8_channel_0/S_AXI3] [get_bd_intf_pins ps7_0_axi_periph/M06_AXI]
connect_bd_intf_net -intf_net adda_M00_AXI [get_bd_intf_pins processing_system7_0/S_AXI_HP0] [get_bd_intf_pins AC_8_channel_0/M00_AXI]
connect_bd_intf_net -intf_net onoff_config_axi_0_WrSerial [get_bd_intf_ports WrSerial_0] [get_bd_intf_pins AC_8_channel_0/WrSerial_0]
connect_bd_intf_net [get_bd_intf_pins ps7_0_axi_periph/M13_AXI] [get_bd_intf_pins coder/S00_AXI]
connect_bd_intf_net [get_bd_intf_ports GPIO_BEEP] [get_bd_intf_pins axi_gpio_0/GPIO]
connect_bd_intf_net [get_bd_intf_pins ps7_0_axi_periph/M04_AXI] [get_bd_intf_pins lcd/PWM_AXI]
connect_bd_intf_net [get_bd_intf_ports KeyBoard_IIC] [get_bd_intf_pins key_board/IIC_0]
connect_bd_intf_net [get_bd_intf_pins ps7_0_axi_periph/M00_AXI] [get_bd_intf_pins lcd/S_AXI_LITE]
connect_bd_intf_net [get_bd_intf_pins ps7_0_axi_periph/M10_AXI] [get_bd_intf_pins axi_gpio_0/S_AXI]
connect_bd_intf_net -intf_net axi_mem_intercon_M00_AXI [get_bd_intf_pins lcd/M00_AXI] [get_bd_intf_pins processing_system7_0/S_AXI_HP1]
connect_bd_intf_net [get_bd_intf_pins ps7_0_axi_periph/M11_AXI] [get_bd_intf_pins axi_uartlite_0/S_AXI]
connect_bd_intf_net [get_bd_intf_ports RGMII_0] [get_bd_intf_pins gmii2rgmii_0/RGMII]
connect_bd_intf_net [get_bd_intf_pins ps7_0_axi_periph/M14_AXI] [get_bd_intf_pins RTC_EEPROM/S_AXI]
connect_bd_intf_net [get_bd_intf_ports RTCEEPROM_IIC] [get_bd_intf_pins RTC_EEPROM/IIC_0]
connect_bd_intf_net [get_bd_intf_pins ps7_0_axi_periph/M12_AXI] [get_bd_intf_pins key_board/S_AXI]
connect_bd_intf_net -intf_net onoff_config_axi_0_OnOff [get_bd_intf_ports OnOff_0] [get_bd_intf_pins AC_8_channel_0/OnOff_0]
connect_bd_intf_net [get_bd_intf_pins gmii2rgmii_0/GMII] [get_bd_intf_pins processing_system7_0/GMII_ETHERNET_1]
connect_bd_intf_net [get_bd_intf_ports IIC_LCD_0] [get_bd_intf_pins processing_system7_0/IIC_1]
connect_bd_intf_net [get_bd_intf_pins ps7_0_axi_periph/M03_AXI] [get_bd_intf_pins lcd/S_AXI]
connect_bd_intf_net [get_bd_intf_pins AC_8_channel_0/S_AXI_LITE] [get_bd_intf_pins ps7_0_axi_periph/M05_AXI]
connect_bd_intf_net [get_bd_intf_pins power_pulse_v1_AXI_0/S_AXI] [get_bd_intf_pins ps7_0_axi_periph/M15_AXI]
connect_bd_intf_net [get_bd_intf_pins processing_system7_0/S_AXI_HP2] [get_bd_intf_pins AC_8_channel_0/M01_AXI]
connect_bd_intf_net -intf_net rgb2lcd_0_rgb_data [get_bd_intf_ports rgb_data] [get_bd_intf_pins lcd/rgb_data]
connect_bd_net [get_bd_pins processing_system7_0/FCLK_CLK0] \
  [get_bd_pins rst_ps7_0_100M/slowest_sync_clk] [get_bd_pins processing_system7_0/M_AXI_GP0_ACLK] \
  [get_bd_pins ps7_0_axi_periph/ACLK] [get_bd_pins ps7_0_axi_periph/S00_ACLK] [get_bd_pins ps7_0_axi_periph/M00_ACLK] \
  [get_bd_pins ps7_0_axi_periph/M01_ACLK] [get_bd_pins ps7_0_axi_periph/M02_ACLK] [get_bd_pins ps7_0_axi_periph/M03_ACLK] \
  [get_bd_pins ps7_0_axi_periph/M04_ACLK] [get_bd_pins ps7_0_axi_periph/M05_ACLK] [get_bd_pins ps7_0_axi_periph/M06_ACLK] \
  [get_bd_pins ps7_0_axi_periph/M07_ACLK] [get_bd_pins ps7_0_axi_periph/M08_ACLK] [get_bd_pins ps7_0_axi_periph/M09_ACLK] \
  [get_bd_pins processing_system7_0/S_AXI_HP0_ACLK] [get_bd_pins lcd/s_axi_aclk] [get_bd_pins axi_gpio_0/s_axi_aclk] \
  [get_bd_pins ps7_0_axi_periph/M10_ACLK] [get_bd_pins key_board/s_axi_aclk] [get_bd_pins ps7_0_axi_periph/M12_ACLK] \
  [get_bd_pins coder/s00_axi_aclk] [get_bd_pins ps7_0_axi_periph/M13_ACLK] [get_bd_pins ps7_0_axi_periph/M14_ACLK] \
  [get_bd_pins ps7_0_axi_periph/M15_ACLK] [get_bd_pins axi_uartlite_0/s_axi_aclk] [get_bd_pins ps7_0_axi_periph/M11_ACLK] \
  [get_bd_pins AC_8_channel_0/s_axi_lite_aclk] [get_bd_pins RTC_EEPROM/s_axi_aclk] \
  [get_bd_pins power_pulse_v1_AXI_0/S_AXI_ACLK] [get_bd_pins axi_intc_BareMetal/s_axi_aclk] \
  [get_bd_pins ps7_0_axi_periph/M16_ACLK] [get_bd_pins ps7_0_axi_periph/M17_ACLK] \
  [get_bd_pins processing_system7_0/S_AXI_HP2_ACLK]
connect_bd_net [get_bd_pins processing_system7_0/FCLK_RESET0_N] \
  [get_bd_pins rst_ps7_0_100M/ext_reset_in] [get_bd_pins proc_sys_reset_0/ext_reset_in] [get_bd_pins lcd/ext_reset_in]
connect_bd_net [get_bd_pins rst_ps7_0_100M/peripheral_aresetn] \
  [get_bd_pins ps7_0_axi_periph/ARESETN] [get_bd_pins ps7_0_axi_periph/S00_ARESETN] \
  [get_bd_pins ps7_0_axi_periph/M00_ARESETN] [get_bd_pins ps7_0_axi_periph/M01_ARESETN] \
  [get_bd_pins ps7_0_axi_periph/M02_ARESETN] [get_bd_pins ps7_0_axi_periph/M03_ARESETN] \
  [get_bd_pins ps7_0_axi_periph/M04_ARESETN] [get_bd_pins ps7_0_axi_periph/M05_ARESETN] \
  [get_bd_pins ps7_0_axi_periph/M06_ARESETN] [get_bd_pins ps7_0_axi_periph/M07_ARESETN] \
  [get_bd_pins ps7_0_axi_periph/M08_ARESETN] [get_bd_pins ps7_0_axi_periph/M09_ARESETN] [get_bd_pins lcd/s_axi_aresetn] \
  [get_bd_pins axi_gpio_0/s_axi_aresetn] [get_bd_pins ps7_0_axi_periph/M10_ARESETN] [get_bd_pins key_board/s_axi_aresetn] \
  [get_bd_pins ps7_0_axi_periph/M12_ARESETN] [get_bd_pins coder/s00_axi_aresetn] [get_bd_pins ps7_0_axi_periph/M13_ARESETN] \
  [get_bd_pins ps7_0_axi_periph/M14_ARESETN] [get_bd_pins ps7_0_axi_periph/M15_ARESETN] \
  [get_bd_pins axi_uartlite_0/s_axi_aresetn] [get_bd_pins ps7_0_axi_periph/M11_ARESETN] \
  [get_bd_pins AC_8_channel_0/S_AXI_ARESETN] [get_bd_pins RTC_EEPROM/s_axi_aresetn] \
  [get_bd_pins power_pulse_v1_AXI_0/S_AXI_ARESETN] [get_bd_pins axi_intc_BareMetal/s_axi_aresetn] \
  [get_bd_pins ps7_0_axi_periph/M16_ARESETN] [get_bd_pins ps7_0_axi_periph/M17_ARESETN]
connect_bd_net -net PWM_0_pwm [get_bd_pins lcd/lcd_bl] [get_bd_ports lcd_bl]
connect_bd_net -net v_axi4s_vid_out_0_vid_active_video [get_bd_pins lcd/lcd_de] [get_bd_ports lcd_de]
connect_bd_net -net v_axi4s_vid_out_0_vid_hsync [get_bd_pins lcd/lcd_hsync] [get_bd_ports lcd_hsync]
connect_bd_net -net v_axi4s_vid_out_0_vid_vsync [get_bd_pins lcd/lcd_vsync] [get_bd_ports lcd_vsync]
connect_bd_net -net clk_wiz_0_clk_out1 [get_bd_pins lcd/lcd_clk] [get_bd_ports lcd_clk]
connect_bd_net [get_bd_pins processing_system7_0/FCLK_CLK1] [get_bd_pins proc_sys_reset_0/slowest_sync_clk] [get_bd_pins AC_8_channel_0/CLK25MHz]
connect_bd_net [get_bd_pins processing_system7_0/FCLK_CLK2] [get_bd_pins processing_system7_0/S_AXI_HP1_ACLK] [get_bd_pins lcd/ACLK]
connect_bd_net -net Op1_0_2 [get_bd_ports Coder_Int] [get_bd_pins coder/Op1_0]
connect_bd_net -net a_in_0_1 [get_bd_ports Coder_A] [get_bd_pins coder/a_in_0]
connect_bd_net -net b_in_0_1 [get_bd_ports Coder_B] [get_bd_pins coder/b_in_0]
connect_bd_net [get_bd_pins processing_system7_0/FCLK_CLK3] [get_bd_pins gmii2rgmii_0/idelay_clk]
connect_bd_net [get_bd_pins power_pulse_v1_AXI_0/pulse_p_out] [get_bd_ports pulse_p_out_0]
connect_bd_net [get_bd_pins power_pulse_v1_AXI_0/pulse_q_out] [get_bd_ports pulse_q_out_0]
connect_bd_net -net pulse_p_in_0_1 [get_bd_ports pulse_p_in_0] [get_bd_pins power_pulse_v1_AXI_0/pulse_p_in]
connect_bd_net -net pulse_q_in_0_1 [get_bd_ports pulse_q_in_0] [get_bd_pins power_pulse_v1_AXI_0/pulse_q_in]
connect_bd_net [get_bd_pins AC_8_channel_0/yad_os_0] [get_bd_ports yad_os_0]
connect_bd_net [get_bd_pins proc_sys_reset_0/peripheral_aresetn] [get_bd_pins AC_8_channel_0/CLK25MHz_ARESETN]
connect_bd_net -net Op1_0_0_1 [get_bd_ports key_BoardINT0] [get_bd_pins key_board/Op1_0]
connect_bd_net -net clk_10MHz_0_1 [get_bd_ports clk_10MHz_0] [get_bd_pins AC_8_channel_0/clk_10MHz_0]
connect_bd_net -net pps_gps_0_1 [get_bd_ports pps_gps_0] [get_bd_pins AC_8_channel_0/pps_gps_0]
connect_bd_net -net pps_in_0_1 [get_bd_ports pps_in_0] [get_bd_pins AC_8_channel_0/pps_in_0]
connect_bd_net -net irig_b_in_0_1 [get_bd_ports irig_b_in_0] [get_bd_pins AC_8_channel_0/irig_b_in_0]
connect_bd_net [get_bd_pins AC_8_channel_0/pps_50_0] [get_bd_ports pps_50_0]
connect_bd_net [get_bd_pins AC_8_channel_0/irig_b_out_0] [get_bd_ports irig_b_out_0]
connect_bd_net [get_bd_pins lcd/mm2s_introut] [get_bd_pins xlconcat/In0]
connect_bd_net [get_bd_pins lcd/irq] [get_bd_pins xlconcat/In1]
connect_bd_net [get_bd_pins key_board/iic2intc_irpt] [get_bd_pins xlconcat/In2]
connect_bd_net [get_bd_pins key_board/Res] [get_bd_pins xlconcat/In3]
connect_bd_net [get_bd_pins coder/intrpt] [get_bd_pins xlconcat/In4]
connect_bd_net [get_bd_pins coder/Res] [get_bd_pins xlconcat/In5]
connect_bd_net [get_bd_pins AC_8_channel_0/prog_empty] [get_bd_pins xlconcat_BareMetal/In2]
connect_bd_net [get_bd_pins AC_8_channel_0/onoff_done] [get_bd_pins xlconcat_BareMetal/In3]
connect_bd_net [get_bd_pins power_pulse_v1_AXI_0/intrpt_p] [get_bd_pins xlconcat_BareMetal/In4]
connect_bd_net [get_bd_pins power_pulse_v1_AXI_0/intrpt_q] [get_bd_pins xlconcat_BareMetal/In5]
connect_bd_net [get_bd_pins axi_uartlite_0/interrupt] [get_bd_pins xlconcat_BareMetal/In6]
connect_bd_net [get_bd_pins AC_8_channel_0/bm_syn_end] [get_bd_pins xlconcat_BareMetal/In7]
connect_bd_net [get_bd_pins AC_8_channel_0/date_update] [get_bd_pins xlconcat_BareMetal/In8]
connect_bd_net [get_bd_pins AC_8_channel_0/pps_in2cpu] [get_bd_pins xlconcat_BareMetal/In9]
connect_bd_net [get_bd_pins AC_8_channel_0/s2mm_introut] [get_bd_pins xlconcat_BareMetal/In0]
connect_bd_net [get_bd_pins AC_8_channel_0/mm2s_introut] [get_bd_pins xlconcat_BareMetal/In1]
connect_bd_net -net xlconcat_0_dout [get_bd_pins xlconcat_BareMetal/dout] [get_bd_pins axi_intc_BareMetal/intr]
connect_bd_net [get_bd_pins xlconcat/dout] [get_bd_pins processing_system7_0/IRQ_F2P]
connect_bd_net [get_bd_pins axi_intc_BareMetal/irq] [get_bd_pins processing_system7_0/Core1_nIRQ]
connect_bd_net [get_bd_pins AC_8_channel_0/time_up] [get_bd_pins xlconcat_BareMetal/In10]
connect_bd_net [get_bd_pins AC_8_channel_0/pps_gps2cpu] [get_bd_pins xlconcat_BareMetal/In11]
set_property HDL_ATTRIBUTE.BMM_INFO_PROCESSOR {arm > system AC_8_channel_0/adda/axi_bram_ctrl_0} [get_bd_cells processing_system7_0]
set_property HDL_ATTRIBUTE.KEEP_HIERARCHY yes [get_bd_cells processing_system7_0]

# ---- address map ----
assign_bd_address -offset 0x00000000 -range 1G -target_address_space [get_bd_addr_spaces AC_8_channel_0/adda/axi_cdma_0/Data] [get_bd_addr_segs processing_system7_0/S_AXI_HP2/HP2_DDR_LOWOCM]
assign_bd_address -offset 0xC0000000 -range 16K -target_address_space [get_bd_addr_spaces AC_8_channel_0/adda/axi_cdma_0/Data] [get_bd_addr_segs AC_8_channel_0/adda/axi_bram_ctrl_1/S_AXI/Mem0]
assign_bd_address -offset 0x2E800000 -range 8M -target_address_space [get_bd_addr_spaces AC_8_channel_0/adda/axi_dma_0/Data_MM2S] [get_bd_addr_segs processing_system7_0/S_AXI_HP0/HP0_DDR_LOWOCM]
assign_bd_address -offset 0x2E800000 -range 8M -target_address_space [get_bd_addr_spaces AC_8_channel_0/adda/axi_dma_0/Data_S2MM] [get_bd_addr_segs processing_system7_0/S_AXI_HP0/HP0_DDR_LOWOCM]
assign_bd_address -offset 0x00000000 -range 256M -target_address_space [get_bd_addr_spaces lcd/axi_vdma_0/Data_MM2S] [get_bd_addr_segs processing_system7_0/S_AXI_HP1/HP1_DDR_LOWOCM]
assign_bd_address -offset 0x40400000 -range 64K -target_address_space [get_bd_addr_spaces processing_system7_0/Data] [get_bd_addr_segs AC_8_channel_0/adda/axi_dma_0/S_AXI_LITE/Reg]
assign_bd_address -offset 0x41200000 -range 64K -target_address_space [get_bd_addr_spaces processing_system7_0/Data] [get_bd_addr_segs axi_gpio_0/S_AXI/Reg]
assign_bd_address -offset 0x41210000 -range 64K -target_address_space [get_bd_addr_spaces processing_system7_0/Data] [get_bd_addr_segs lcd/axi_gpio_0/S_AXI/Reg]
assign_bd_address -offset 0x41600000 -range 64K -target_address_space [get_bd_addr_spaces processing_system7_0/Data] [get_bd_addr_segs RTC_EEPROM/axi_iic_0/S_AXI/Reg]
assign_bd_address -offset 0x41610000 -range 64K -target_address_space [get_bd_addr_spaces processing_system7_0/Data] [get_bd_addr_segs key_board/axi_iic_0/S_AXI/Reg]
assign_bd_address -offset 0x41800000 -range 64K -target_address_space [get_bd_addr_spaces processing_system7_0/Data] [get_bd_addr_segs axi_intc_BareMetal/S_AXI/Reg]
assign_bd_address -offset 0x42C00000 -range 64K -target_address_space [get_bd_addr_spaces processing_system7_0/Data] [get_bd_addr_segs axi_uartlite_0/S_AXI/Reg]
assign_bd_address -offset 0x43000000 -range 64K -target_address_space [get_bd_addr_spaces processing_system7_0/Data] [get_bd_addr_segs lcd/axi_vdma_0/S_AXI_LITE/Reg]
assign_bd_address -offset 0x43C00000 -range 64K -target_address_space [get_bd_addr_spaces processing_system7_0/Data] [get_bd_addr_segs AC_8_channel_0/adda/adc_whole_0/S_AXI/reg0]
assign_bd_address -offset 0x43C10000 -range 64K -target_address_space [get_bd_addr_spaces processing_system7_0/Data] [get_bd_addr_segs AC_8_channel_0/adda/dac_whole_0/S_AXI/reg0]
assign_bd_address -offset 0x43C20000 -range 64K -target_address_space [get_bd_addr_spaces processing_system7_0/Data] [get_bd_addr_segs AC_8_channel_0/stimer_onoff_pa_rw_A_0/S_AXI/reg0]
assign_bd_address -offset 0x43C30000 -range 64K -target_address_space [get_bd_addr_spaces processing_system7_0/Data] [get_bd_addr_segs coder/coder_0/S00_AXI/S00_AXI_reg]
assign_bd_address -offset 0x43C40000 -range 64K -target_address_space [get_bd_addr_spaces processing_system7_0/Data] [get_bd_addr_segs lcd/PWM_0/PWM_AXI/PWM_AXI_reg]
assign_bd_address -offset 0x43C50000 -range 64K -target_address_space [get_bd_addr_spaces processing_system7_0/Data] [get_bd_addr_segs lcd/clk_wiz_0/s_axi_lite/Reg]
assign_bd_address -offset 0x43C60000 -range 64K -target_address_space [get_bd_addr_spaces processing_system7_0/Data] [get_bd_addr_segs lcd/v_tc_0/ctrl/Reg]
assign_bd_address -offset 0x43C70000 -range 64K -target_address_space [get_bd_addr_spaces processing_system7_0/Data] [get_bd_addr_segs power_pulse_v1_AXI_0/S_AXI/reg0]
assign_bd_address -offset 0x7E200000 -range 64K -target_address_space [get_bd_addr_spaces processing_system7_0/Data] [get_bd_addr_segs AC_8_channel_0/adda/axi_cdma_0/S_AXI_LITE/Reg]

validate_bd_design
save_bd_design
